# Altium schematic sheet [06] - MP3 Player.SchDoc: =ProjectName
size A4; CheckedBy: Ven; Author: Ven; CompanyName: HUST; Revision: V.1.0
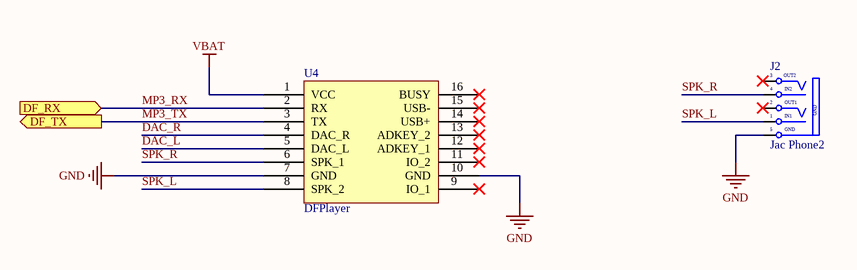
[diagram p0: [06] - MP3 Player.SchDoc]

## Parts
J2  Jac Phone2  [JAC_PHONE2]
U4  DFPlayer  [DFPlayer]

## Ports
DF_RX (in), DF_TX (out)

## Nets
GND: J2.5(GND) U4.7(GND) U4.10(GND)
VBAT: U4.1(VCC)
DAC_L: U4.5(DAC_L)
DAC_R: U4.4(DAC_R)
MP3_RX: U4.2(RX) ; port DF_RX
MP3_TX: U4.3(TX) ; port DF_TX
SPK_L: J2.1(S1) U4.8(SPK_2)
SPK_R: J2.4(S) U4.6(SPK_1)

Not connected (* = marked no-connect by the designer): J2 2(S1)* 3(TN)*; U4 9(IO_1)* 11(IO_2)* 12(ADKEY_1)* 13(ADKEY_2)* 14(USB+)* 15(USB-)* 16(BUSY)*

## Notes on the sheet
- Project:
- Page Contents:
- Size:
- Date:
- A4
- Checked by:
- Time:
- Revision:
- Sheet
- of
- File:
- (in symbol Jac Phone2) OUT2; IN2; OUT1; IN1

## Library data of the parts
J2 = Jac Phone2: Jac Phone Stereo; Creat by: VanDungEvn@Gmail.com